# EAGLE design AT4004 (EAGLE 9.2.0)
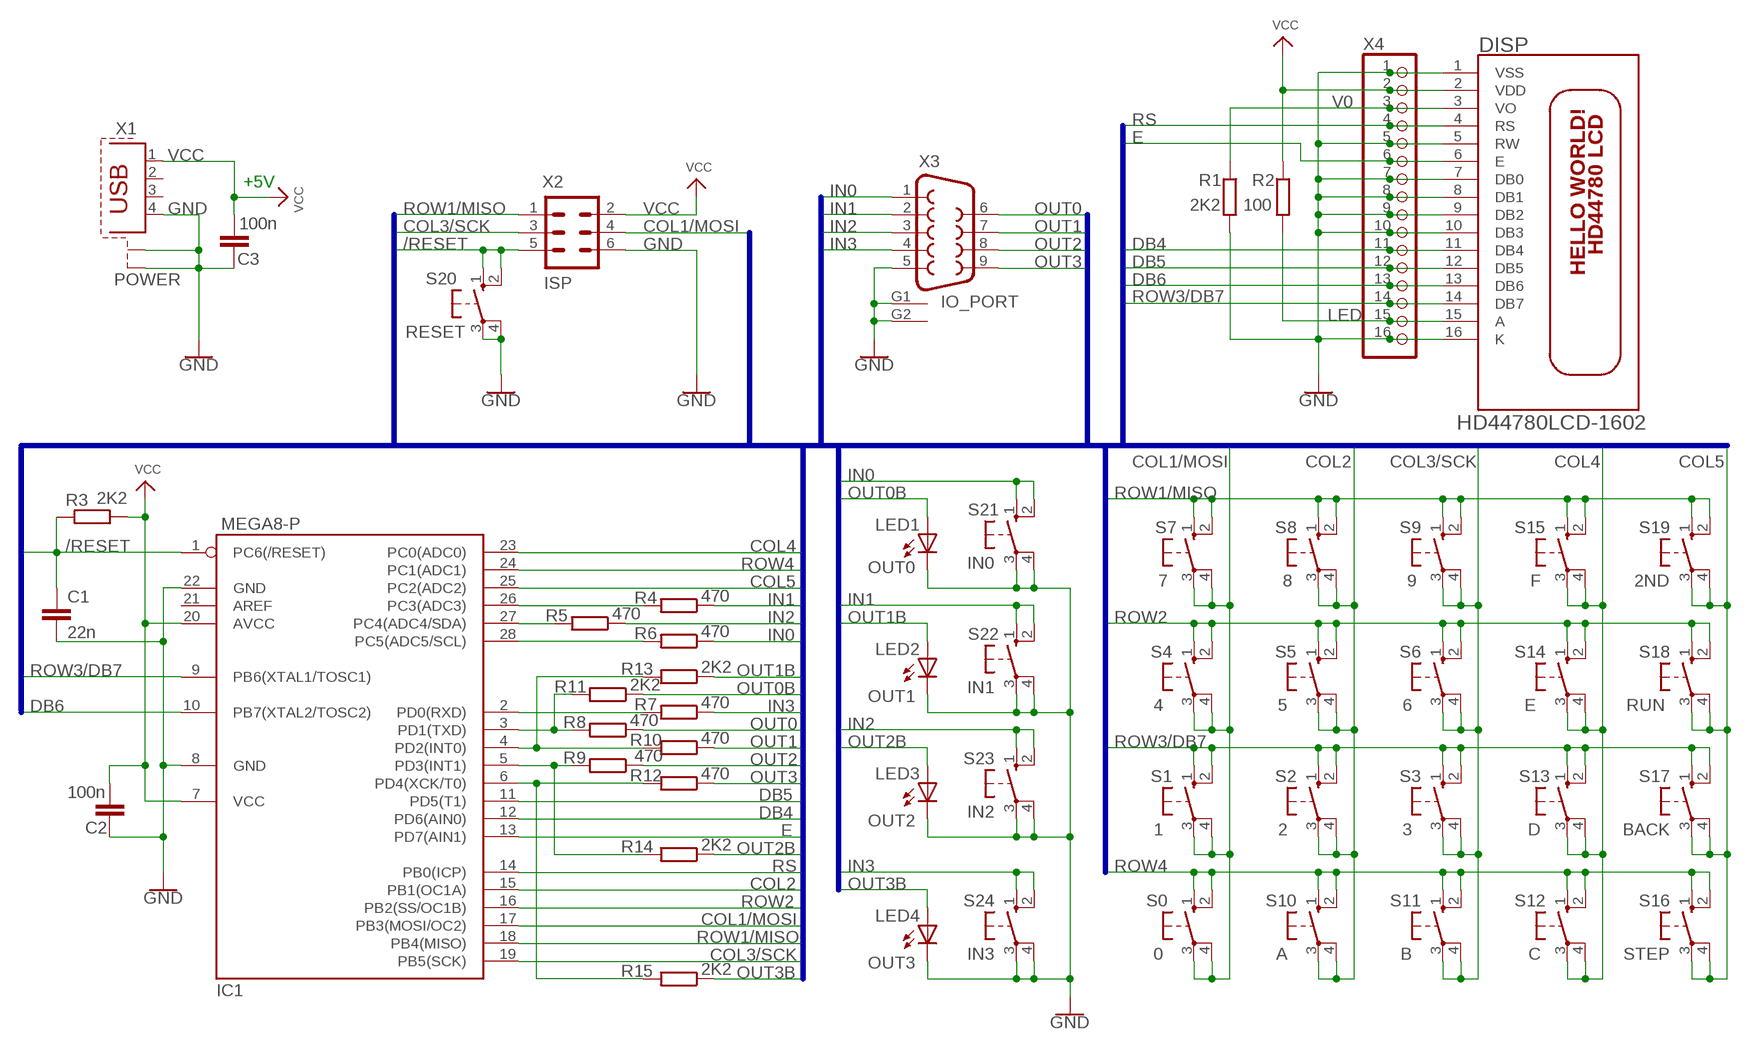
[diagram p0: schematic, sheet 1]

## Parts
C1  22n  C-EU050-024X044  [C050-024X044]
C2  100n  C-EU050-024X044  [C050-024X044]
C3  100n  C-EU050-024X044  [C050-024X044]
DISP  HD44780LCD-1602  [LCD1602]
IC1  MEGA8-P  [DIL28-3]
LED1  OUT0  LED3MM  [LED3MM]
LED2  OUT1  LED3MM  [LED3MM]
LED3  OUT2  LED3MM  [LED3MM]
LED4  OUT3  LED3MM  [LED3MM]
R1  2K2  R-EU_0204/10  [0204/10]
R2  100  R-EU_0204/10  [0204/10]
R3  2K2  R-EU_0204/7  [0204/7]
R4  470  R-EU_0204/10  [0204/10]
R5  470  R-EU_0204/10  [0204/10]
R6  470  R-EU_0204/7  [0204/7]
R7  470  R-EU_0204/10  [0204/10]
R8  470  R-EU_0204/10  [0204/10]
R9  470  R-EU_0204/7  [0204/7]
R10  470  R-EU_0204/10  [0204/10]
R11  2K2  R-EU_0204/10  [0204/10]
R12  470  R-EU_0204/10  [0204/10]
R13  2K2  R-EU_0204/10  [0204/10]
R14  2K2  R-EU_0204/10  [0204/10]
R15  2K2  R-EU_0204/10  [0204/10]
S0  0  10-XX  [B3F-10XX]
S1  1  10-XX  [B3F-10XX]
S2  2  10-XX  [B3F-10XX]
S3  3  10-XX  [B3F-10XX]
S4  4  10-XX  [B3F-10XX]
S5  5  10-XX  [B3F-10XX]
S6  6  10-XX  [B3F-10XX]
S7  7  10-XX  [B3F-10XX]
S8  8  10-XX  [B3F-10XX]
S9  9  10-XX  [B3F-10XX]
S10  A  10-XX  [B3F-10XX]
S11  B  10-XX  [B3F-10XX]
S12  C  10-XX  [B3F-10XX]
S13  D  10-XX  [B3F-10XX]
S14  E  10-XX  [B3F-10XX]
S15  F  10-XX  [B3F-10XX]
S16  STEP  10-XX  [B3F-10XX]
S17  BACK  10-XX  [B3F-10XX]
S18  RUN  10-XX  [B3F-10XX]
S19  2ND  10-XX  [B3F-10XX]
S20  RESET  10-XX  [B3F-10XX]
S21  IN0  10-XX  [B3F-10XX]
S22  IN1  10-XX  [B3F-10XX]
S23  IN2  10-XX  [B3F-10XX]
S24  IN3  10-XX  [B3F-10XX]
X1  POWER  PN61729-S  [PN61729-S]
X2  ISP  ML6  [ML6]
X3  IO_PORT  DB9FEMALE  [DB9]
X4  PINHD-1X16/90  [1X16/90]

## Nets
/RESET: C1.1 IC1.1(PC6(/RESET)) R3.2 S20.1(S) S20.2(S1) X2.5
COL1/MOSI: IC1.17(PB3(MOSI/OC2)) S0.3(P) S0.4(P1) S1.3(P) S1.4(P1) S4.3(P) S4.4(P1) S7.3(P) S7.4(P1) X2.4
COL2: IC1.15(PB1(OC1A)) S2.3(P) S2.4(P1) S5.3(P) S5.4(P1) S8.3(P) S8.4(P1) S10.3(P) S10.4(P1)
COL3/SCK: IC1.19(PB5(SCK)) S3.3(P) S3.4(P1) S6.3(P) S6.4(P1) S9.3(P) S9.4(P1) S11.3(P) S11.4(P1) X2.3
COL4: IC1.23(PC0(ADC0)) S12.3(P) S12.4(P1) S13.3(P) S13.4(P1) S14.3(P) S14.4(P1) S15.3(P) S15.4(P1)
COL5: IC1.25(PC2(ADC2)) S16.3(P) S16.4(P1) S17.3(P) S17.4(P1) S18.3(P) S18.4(P1) S19.3(P) S19.4(P1)
DB4: DISP.11(DB4) IC1.12(PD6(AIN0)) X4.11
DB5: DISP.12(DB5) IC1.11(PD5(T1)) X4.12
DB6: DISP.13(DB6) IC1.10(PB7(XTAL2/TOSC2)) X4.13
E: DISP.6(E) IC1.13(PD7(AIN1)) X4.6
GND: C1.2 C2.2 C3.1 DISP.1(VSS) DISP.5(RW) DISP.7(DB0) DISP.8(DB1) DISP.9(DB2) DISP.10(DB3) DISP.16(K) IC1.8(GND) IC1.22(GND) LED1.K(C) LED2.K(C) LED3.K(C) LED4.K(C) R1.2 S20.3(P) S20.4(P1) S21.3(P) S21.4(P1) S22.3(P) S22.4(P1) S23.3(P) S23.4(P1) S24.3(P) S24.4(P1) X1.4 X1.S1 X1.S2 X2.6 X3.5 X3.G1 X3.G2 X4.1 X4.5 X4.7 X4.8 X4.9 X4.10 X4.16
IN0: R6.1 S21.1(S) S21.2(S1) X3.1
IN1: R4.1 S22.1(S) S22.2(S1) X3.2
IN2: R5.1 S23.1(S) S23.2(S1) X3.3
IN3: R7.1 S24.1(S) S24.2(S1) X3.4
LED: DISP.15(A) R2.2 X4.15
N$1: IC1.26(PC3(ADC3)) R4.2
N$2: IC1.27(PC4(ADC4/SDA)) R5.2
N$3: IC1.28(PC5(ADC5/SCL)) R6.2
N$4: IC1.2(PD0(RXD)) R7.2
N$5: IC1.3(PD1(TXD)) R8.2 R11.2
N$6: IC1.4(PD2(INT0)) R10.2 R13.2
N$7: IC1.5(PD3(INT1)) R9.2 R14.2
N$8: IC1.6(PD4(XCK/T0)) R12.2 R15.2
OUT0: R8.1 X3.6
OUT0B: LED1.A R11.1
OUT1: R10.1 X3.7
OUT1B: LED2.A R13.1
OUT2: R9.1 X3.8
OUT2B: LED3.A R14.1
OUT3: R12.1 X3.9
OUT3B: LED4.A R15.1
ROW1/MISO: IC1.18(PB4(MISO)) S7.1(S) S7.2(S1) S8.1(S) S8.2(S1) S9.1(S) S9.2(S1) S15.1(S) S15.2(S1) S19.1(S) S19.2(S1) X2.1
ROW2: IC1.16(PB2(SS/OC1B)) S4.1(S) S4.2(S1) S5.1(S) S5.2(S1) S6.1(S) S6.2(S1) S14.1(S) S14.2(S1) S18.1(S) S18.2(S1)
ROW3/DB7: DISP.14(DB7) IC1.9(PB6(XTAL1/TOSC1)) S1.1(S) S1.2(S1) S2.1(S) S2.2(S1) S3.1(S) S3.2(S1) S13.1(S) S13.2(S1) S17.1(S) S17.2(S1) X4.14
ROW4: IC1.24(PC1(ADC1)) S0.1(S) S0.2(S1) S10.1(S) S10.2(S1) S11.1(S) S11.2(S1) S12.1(S) S12.2(S1) S16.1(S) S16.2(S1)
RS: DISP.4(RS) IC1.14(PB0(ICP)) X4.4
V0: DISP.3(VO) R1.1 X4.3
VCC: C2.1 C3.2 DISP.2(VDD) IC1.7(VCC) IC1.20(AVCC) R2.1 R3.1 X1.1 X2.2 X4.2
Unconnected: IC1.21(AREF) X1.2 X1.3

## Buses
COL1/MOSI,COL2,COL3/SCK,COL4,COL5,DB4,DB5,DB6,E,IN0,IN1,IN2,IN3,OUT0,OUT0B,OUT1,OUT1B,OUT2,OUT2B,OUT3,OUT3B,/RESET,ROW1/MISO,ROW2,ROW3/DB7,ROW4,RS

## Notes on the sheet
- +5V

## Library data of the parts
C1-C3 = rcl:C-EU: CAPACITOR, European symbol; SPICEPREFIX: C
DISP = adafruit_AT4004:HD44780LCD: HD44780 LCD Standard character type LCDs, available in sizes from 8x1 to 40x4!
IC1 = atmel:MEGA8-P: MICROCONTROLLER 8 Kbytes FLASH, 1 kbytes SRAM, 512 bytes EEPROM, USART, 4-channel 10 bit ADC, 2-channel 8 bit ADC Pin compatible with Atmega48, ATMega88, ATMega168 Source: avr.lbr; OC_FARNELL: unknown; OC_NEWARK: unknown
LED1-LED4 = adafruit:LED: LED OSRAM: - CHIPLED LG R971, LG N971, LY N971, LG Q971, LY Q971, LO R971, LY R971 LH N974, LH R974 LS Q976, LO Q976, LY Q976 LO Q996 - Hyper CHIPLED LW Q18S LB Q993, LB Q99A, LB R99A - SideLED LS A670, LO A670, LY A670, LG A670, LP A670 LB A673, LV A673, LT A673, LW A673 LH A674 LY A675 LS A676, LA A676, LO A676, LY A676, LW A676 LS A679, LY A679, LG A679 - Hyper Micro SIDELED® LS Y876, LA Y876, LO Y876, LY Y876 LT Y87S - SmartLED LW L88C, LW L88S LB L89C, LB L89S, LG L890 LS L89K, LO L89K, LY L89K LS L896, LA L896, LO L896, LY L896 - TOPLED LS T670, LO T670, LY T670, LG T670, LP T670 LSG T670, LSP T670, LSY T670, LOP T670, LYG T670 LG T671, LOG T671, LSG T671 LB T673, LV T673, LT T673, LW T673 LH T674 LS T676, LA T676, LO T676, LY T676, LB T676, LH T676, LSB T676, LW T676 LB T67C, LV T67C, LT T67C, LS T67K, LO T67K, LY T67K, LW E67C LS E67B, LA E67B, LO E67B, LY E67B, LB E67C, LV E67C, LT E67C LW T67C LS T679, LY T679, LG T679 LS T770, LO T770, LY T770, LG T770, LP T770 LB T773, LV T773, LT T773, LW T773 LH T774 LS E675, LA E675, LY E675, LS T675 LS T776, LA T776, LO T776, LY T776, LB T776 LHGB T686 LT T68C, LB T68C - Hyper Mini TOPLED® LB M676 - Mini TOPLED Santana® LG M470 LS M47K, LO M47K, LY M47K Source: http://www.osram.convergy.de/
R1 R2 R4 R5 R7 R8 R10-R15 = rcl:R-EU_: RESISTOR, European symbol
R3 R6 R9 = rcl:R-EU_: RESISTOR, European symbol; SPICEPREFIX: R
S0 S1-S24 = switch-omron2:10-XX: OMRON SWITCH; MPN: B3F-1000; OC_FARNELL: 176432; OC_NEWARK: 36M3542
X1 = con-berg:PN61729-S: BERG USB connector; OC_FARNELL: unknown; OC_NEWARK: unknown
X2 = con-ml:ML6: HARTING; OC_FARNELL: unknown; OC_NEWARK: unknown
X3 = SparkFun-Connectors:DB9: DB9 Connector Standard DB9 (D-Sub 9) serial connector. Can be used for CAN bus as well as RS485 and RS232. Footprint production proven. Here is the female version connector we sell at SparkFun: 9 Pin Female Serial Connector - PCB Mount <https://www.sparkfun.com/products/429> (PRT-00429) This connector has been used on the following SparkFun products: SparkFun RS232 Shifter - SMD <https://www.sparkfun.com/products/449> (PRT-00449) SparkFun RS232 Shifter SMD (No DB9) <https://www.sparkfun.com/products/8780> (PRT-08780); PROD_ID: CONN-08194
X4 = pinhead:PINHD-1X16: PIN HEADER

## Board
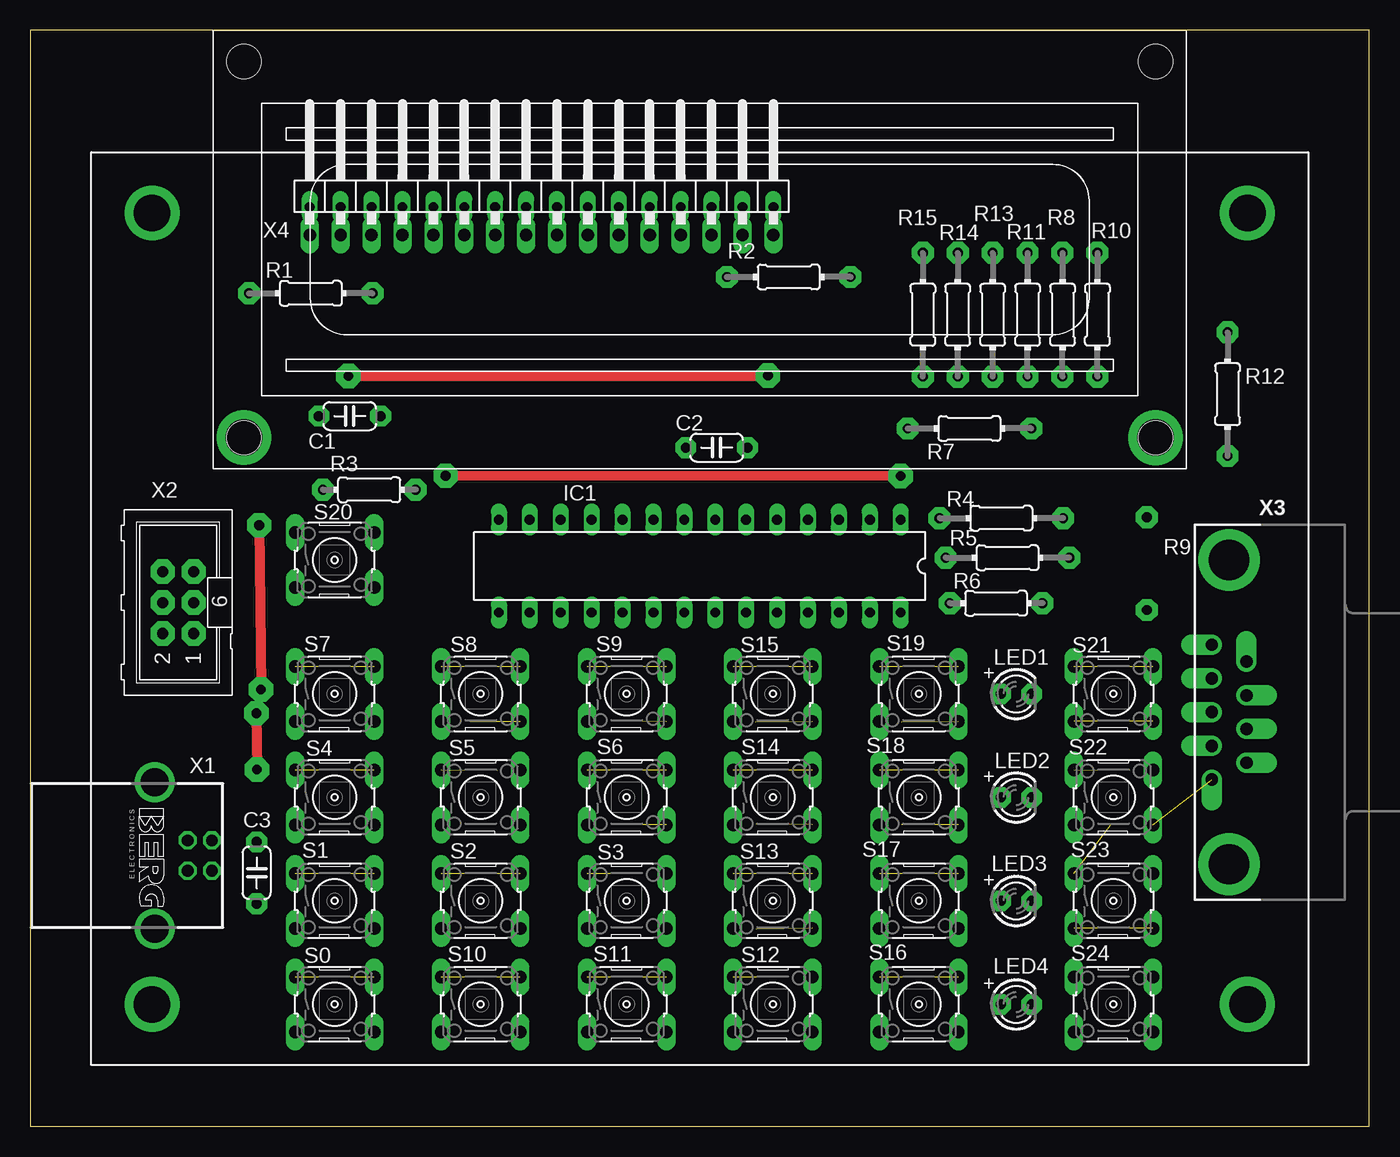
[diagram p1: board, top side]
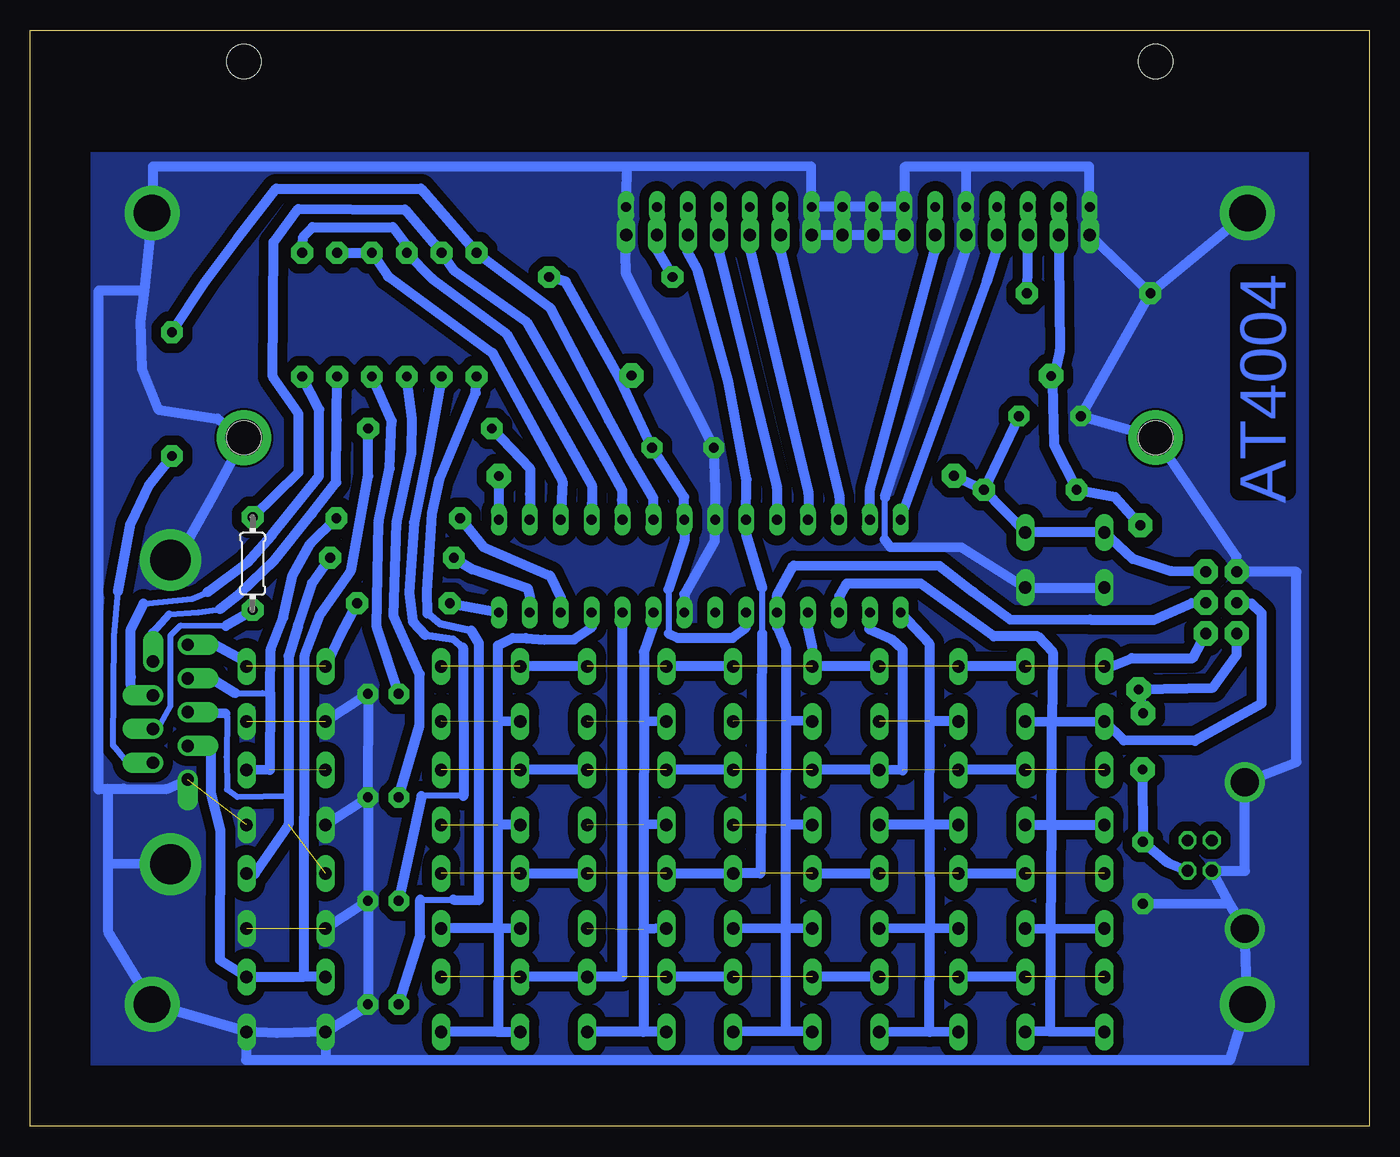
[diagram p2: board, bottom side, seen from below]

Size 110 x 90 mm. Coordinates in mm from the lower left corner, seen from the top.
Outline: 0,0 110,0 110,90 0,90 0,0
Copper layers (1*16): Top 0.035mm / dielectric 1.5mm / Bottom 0.035mm
Design rules "default": minimum track width 6mil, minimum drill 0.35mm, track to track 6mil, track to pad 6mil, pad to pad 6mil, via to via 6mil, smd to smd 6mil, copper to edge 40mil, drill to drill 6mil, minimum pad ring 10mil, minimum via ring 8mil, stop-mask expansion 4mil, vias tented up to drill 0mil, thermal gap 10mil

### Footprints (pad centres in the part's own frame; a part is rotated, then mirrored left to right if it is on the bottom)
C050-024X044 = drill 0.813 pad 1.7 octagon: 1 -2.54,0; 2 2.54,0
LCD1602 = drill 0.8 long: 1 7.949,21.5; 2 10.489,21.5; 3 13.029,21.5; 4 15.569,21.5; 5 18.109,21.5; 6 20.649,21.5; 7 23.189,21.5; 8 25.729,21.5; 9 28.269,21.5; 10 30.809,21.5; 11 33.349,21.5; 12 35.889,21.5; 13 38.429,21.5; 14 40.969,21.5; 15 43.509,21.5; 16 46.049,21.5 | hole 2.8: 2.54,2.54; 2.54,33.46; 77.46,33.46; 77.46,2.54
DIL28-3 = drill 0.813 long: 1 -16.51,-3.81; 2 -13.97,-3.81; 3 -11.43,-3.81; 4 -8.89,-3.81; 5 -6.35,-3.81; 6 -3.81,-3.81; 7 -1.27,-3.81; 8 1.27,-3.81; 9 3.81,-3.81; 10 6.35,-3.81; 11 8.89,-3.81; 12 11.43,-3.81; 13 13.97,-3.81; 14 16.51,-3.81; 15 16.51,3.81; 16 13.97,3.81; 17 11.43,3.81; 18 8.89,3.81; 19 6.35,3.81; 20 3.81,3.81; 21 1.27,3.81; 22 -1.27,3.81; 23 -3.81,3.81; 24 -6.35,3.81; 25 -8.89,3.81; 26 -11.43,3.81; 27 -13.97,3.81; 28 -16.51,3.81
LED3MM = drill 0.813 pad 1.676 octagon: A -1.27,0; K 1.27,0
0204/10 = drill 0.813 pad 1.8 octagon: 1 -5.08,0; 2 5.08,0
0204/7 = drill 0.813 pad 1.8 octagon: 1 -3.81,0; 2 3.81,0
B3F-10XX = drill 1.016 long: 1 -3.251,2.261; 2 3.251,2.261; 3 -3.251,-2.261; 4 3.251,-2.261
PN61729-S = drill 0.95 octagon: 1 1.25,4.71; 2 -1.25,4.71; 3 -1.25,2.71; 4 1.25,2.71 | drill 2.3 pad 2.9: S1 -6.02,0; S2 6.02,0
ML6 = drill 0.914 pad 2 octagon: 1 -2.54,-1.27; 2 -2.54,1.27; 3 0,-1.27; 4 0,1.27; 5 2.54,-1.27; 6 2.54,1.27
DB9 = drill 1.016 pad 1.676 offset: 1 -5.54,-1.42; 2 -2.77,-1.42; 3 0,-1.42; 4 2.77,-1.42; 5 5.54,-1.42; 6 -4.15,1.42; 7 -1.38,1.42; 8 1.38,1.42; 9 4.15,1.42 | drill 3.302 pad 5.08: G1 -12.5,0; G2 12.5,0
1X16/90 = drill 1.016 long: 1 -19.05,-3.81; 2 -16.51,-3.81; 3 -13.97,-3.81; 4 -11.43,-3.81; 5 -8.89,-3.81; 6 -6.35,-3.81; 7 -3.81,-3.81; 8 -1.27,-3.81; 9 1.27,-3.81; 10 3.81,-3.81; 11 6.35,-3.81; 12 8.89,-3.81; 13 11.43,-3.81; 14 13.97,-3.81; 15 16.51,-3.81; 16 19.05,-3.81

### Placement (x,y rotation side)
C1  26.24,58.32 180 top
C2  56.39,55.73 180 top
C3  18.59,20.8 90 top
DISP  15,54 0 top
IC1  55,46 180 top
LED1  81,35.5 0 top
LED2  81,27 0 top
LED3  81,18.5 0 top
LED4  81,10 0 top
R1  23.04,68.4 180 top
R2  62.31,69.75 180 top
R3  27.84,52.27 0 top
R4  79.78,49.94 180 top
R5  80.29,46.69 180 top
R6  79.35,42.95 180 top
R7  77.17,57.3 180 top
R8  84.81,66.65 90 top
R9  91.74,46.2 90 bottom
R10  87.68,66.65 90 top
R11  81.94,66.65 90 top
R12  98.37,60.12 90 top
R13  79.07,66.65 90 top
R14  76.2,66.65 90 top
R15  73.33,66.65 90 top
S0  25,10 0 top
S1  25,18.5 0 top
S2  37,18.5 0 top
S3  49,18.5 0 top
S4  25,27 0 top
S5  37,27 0 top
S6  49,27 0 top
S7  25,35.5 0 top
S8  37,35.5 0 top
S9  49,35.5 0 top
S10  37,10 0 top
S11  49,10 0 top
S12  61,10 0 top
S13  61,18.5 0 top
S14  61,27 0 top
S15  61,35.5 0 top
S16  73,10 0 top
S17  73,18.5 0 top
S18  73,27 0 top
S19  73,35.5 0 top
S20  25,46.5 0 top
S21  89,35.5 0 top
S22  89,27 0 top
S23  89,18.5 0 top
S24  89,10 0 top
X1  10.21,22.23 270 top
X2  12.14,43 90 top
X3  98.5,34 270 top
X4  42,77 0 top

### Tracks (layer width: path | path; a pad name or v marks a point on that pad's centre or on a via)
/RESET  (via drill 0.8 pad 2)
  Top 0.813: v71.5,53.39 v34.11,53.42
  Bottom 0.813: C1.1 R3.2 | IC1.1 v71.5,53.39 | v34.11,53.42 R3.2 | X2.5 16.28,45.59 19.43,46.58 S20.1 S20.2 R3.2
COL1/MOSI
  Bottom 0.508: 26.21,7.78 26.24,7.77
  Bottom 0.813: 26.07,33.22 25.98,38.94 27.23,40.23 30.84,40.23 36.83,44.55 42.93,44.55 43.54,43.54 IC1.17 | 26.13,24.74 26.07,33.22 | 26.13,24.74 26.18,16.23 | 26.18,16.23 26.21,7.78 S0.3 | 26.24,7.77 S0.4 | S1.4 26.18,16.23 | S4.4 26.13,24.74 | S7.4 26.07,33.22 | X2.4 9.65,42.93 8.84,42.16 8.84,34.7 14.3,31.65 20.17,31.67 S7.3 26.07,33.22 | 26.18,16.23 S1.3 | 26.13,24.74 S4.3
COL2  (1 unrouted)
  Bottom 0.508: 36.17,24.74 36.12,24.74
  Bottom 0.813: IC1.15 36.14,39.65 36.14,33.25 | 36.14,33.25 36.17,24.74 S5.3 | 36.08,16.23 36.12,24.74 S5.4 | 36.12,7.72 36.08,16.23 | S10.3 36.12,7.72 | S2.3 36.08,16.23 | S8.3 36.14,33.25 | 36.12,7.72 S10.4 | 36.08,16.23 S2.4
COL3/SCK  (2 unrouted)
  Bottom 0.813: 47.9,33.3 47.9,39.24 48.62,40.97 IC1.19 48.64,43.61 47.3,46.05 35.31,46.02 32.51,43.87 29.52,41.63 22.91,41.6 17.7,41.58 14.61,42.95 X2.3 | 47.9,33.3 47.94,24.74 | 47.94,24.74 47.95,16.2 | 47.95,16.2 47.95,7.8 | S11.3 47.95,7.8 | S3.3 47.95,16.2 | S6.3 47.94,24.74 | S9.3 47.9,33.3 | 47.95,7.8 S11.4 | 47.95,16.2 S3.4
COL4  (3 unrouted)
  Bottom 0.813: IC1.23 58.85,41.07 59.59,38.94 59.6,33.19 | 59.6,33.19 59.6,24.79 | 59.6,24.79 59.63,16.18 | 59.63,16.18 59.64,7.75 | S12.3 59.64,7.75 | S13.3 59.63,16.18 | S14.3 59.6,24.79 | S15.3 59.6,33.19 | 59.64,7.75 S12.4
COL5  (2 unrouted)
  Bottom 0.508: 71.56,16.21 71.53,16.23
  Bottom 0.813: 71.56,33.2 71.58,39.5 70.36,40.11 69.29,40.08 67.74,39.95 65.33,39.98 63.86,41 IC1.25 | 71.56,24.74 71.56,33.2 | 71.56,24.74 71.56,16.21 S17.3 | 71.58,7.75 71.53,16.23 S17.4 | 71.58,7.75 S16.3 | S18.3 71.56,24.74 | S19.3 71.56,33.2 | 71.58,7.75 S16.4
DB4
  Bottom 0.813: IC1.12 43.54,51.71 48.39,71.86 X4.11 DISP.11
DB5
  Bottom 0.813: IC1.11 46.08,51.99 50.88,71.98 X4.12 DISP.12
DB6
  Bottom 0.813: IC1.10 48.67,52.45 53.39,71.6 X4.13 DISP.13
E
  Bottom 0.813: IC1.13 41,52.32 35.7,71.77 | 35.7,71.77 35.66,73 X4.6 | DISP.6 35.7,71.77
GND  (via drill 3 pad 4.5)  (3 unrouted)
  Bottom 0.508: 61.05,76.29 X4.16 | 39.8,48.18 39.78,51.64 | LED2.K 82.29,26.95 | LED4.K 82.25,9.85
  Bottom 0.813: S20.3 S20.4 33.48,47.52 39.34,47.55 39.8,48.18 | 11.49,18.29 X1.S2 v10,10 11.4,5.44 85.72,5.45 | 11.49,18.29 X1.4 10.21,20.95 X1.S1 5.97,29.9 5.97,45.52 X2.6 10.9,46.79 v17.54,56.56 C1.2 R1.2 | C3.1 11.49,18.29 | v10,75 R1.2 | R1.2 X4.1 22.99,78.82 33.12,78.82 | 33.12,78.82 X4.5 | 33.12,78.82 38.18,78.79 X4.7 | X4.7 X4.8 | X4.8 X4.9 | X4.9 X4.10 | X4.10 45.81,75.52 | 45.81,75.52 45.82,78.84 61.04,78.82 | 61.04,78.82 61.05,76.29 61.06,73.43 61.08,71.71 | 39.78,51.64 33.12,71.93 X4.5 | IC1.22 56.26,43.69 53.77,48.06 IC1.8 53.72,52.27 C2.2 61.06,70.03 61.08,71.71 | 61.04,78.82 99.95,78.82 v100,75 100.65,68.67 | 100.65,68.67 100.97,66.12 100.84,62.2 99.49,58.85 94.64,58.12 v92.45,56.55 95.05,51.66 97.81,46.79 X3.G1 | S24.4 v100,10 103.61,15.95 103.61,21.56 | 103.61,21.56 103.62,27.7 | 103.62,27.7 102.36,27.71 98.86,27.69 X3.5 | X3.G2 103.61,21.56 | S24.4 92.28,5.44 85.72,5.45 | S21.3 LED1.K 82.29,26.95 S22.3 | LED3.K S23.3 | 85.72,5.45 85.75,7.59 85.19,8.05 82.25,9.85 LED3.K | S24.3 89.74,7.64 S24.4 | LED2.K LED3.K | 103.62,27.7 104.39,27.64 104.37,68.66 100.65,68.67 | DISP.5 X4.5 | X4.7 DISP.7 DISP.8 | DISP.8 X4.8 | DISP.9 X4.9 | DISP.10 X4.10 | DISP.16 61.08,71.71 | DISP.8 DISP.9 | DISP.9 45.81,75.52
  pour Bottom (isolate 0.8, no thermals): 5,5 105,5 105,80 5,80
IN0  (1 unrouted)
  Bottom 0.813: S21.2 92.53,38.28 94.87,39.55 X3.1 | R6.1 84.53,40.34 S21.1
IN1  (1 unrouted)
  Bottom 0.508: 93.14,35.56 90.93,35.56 90.29,35.53
  Bottom 0.813: X3.2 94.94,36.68 93.14,35.56 | S22.2 90.32,29.23 90.29,35.53 90.25,39.17 89.23,41.76 88.44,45.26 87,47.83 R4.1
IN2  (1 unrouted)
  Bottom 0.508: 93.98,33.91 93.85,33.68 93.88,30.3 93.85,27.66 92.99,27.05 88.79,27.12
  Bottom 0.813: X3.3 93.98,33.91 | R5.1 86.87,44.6 88.01,41.15 88.8,38.61 88.79,27.12 88.8,24.77 91.57,20.73 S23.2
IN3
  Bottom 0.813: X3.4 95.15,31.11 95.15,27.33 94.39,24.31 94.41,13.64 S24.2 87.5,12.27 | 87.5,12.27 87.45,38.68 86.21,41.99 83.67,45.62 82.25,53.42 R7.1 | S24.1 87.5,12.27
LED
  Bottom 0.813: R2.2 58.5,71.96 X4.15 DISP.15
N$1
  Bottom 0.813: R4.2 72.8,47.57 67.31,45.21 66.42,43.41 IC1.26
N$2
  Bottom 0.813: R5.2 73.69,45.72 69.14,44.17 68.96,43.36 IC1.27
N$3
  Bottom 0.813: R6.2 IC1.28
N$4
  Bottom 0.813: R7.2 68.96,54.03 68.96,51.92 IC1.2
N$5
  Bottom 0.813: R8.2 84.64,71.75 R11.2 80.62,69.8 72.02,63.49 69.67,59.21 66.29,52.96 66.34,51.41 IC1.3
N$6
  Bottom 0.813: R10.2 87.58,73.05 86.82,73.84 80.21,73.84 79.15,72.42 R13.2 76.98,69.61 70.89,65.08 63.86,52.6 63.86,51.13 IC1.4
N$7
  Bottom 0.813: R9.2 87.96,53.7 87.96,58.5 90.09,61.57 90.02,72.62 87.99,75.34 79.22,75.29 R14.2 75.21,70.31 69.24,66.06 62.84,54.84 61.37,52.22 61.39,51.41 IC1.5
N$8
  Bottom 0.813: R12.2 95.63,69.37 92.94,72.97 89.79,77.01 77.91,77.01 R15.2 67.31,67.24 62.46,57.96 60.63,54.63 58.83,51.59 IC1.6
OUT0
  Bottom 0.508: 98.6,42.04 96.19,42.19 94.44,42.47
  Bottom 0.61: 99.95,40.51 98.6,42.04
  Bottom 0.813: X3.6 99.95,40.51 | 94.44,42.47 92.71,43.81 89.96,46.46 86.88,50.28 84.86,52.88 84.84,57.99 R8.1
OUT0B
  Bottom 0.813: LED1.A 81.54,40.96 81.38,49.63 80.47,54.03 80.31,57.94 R11.1
OUT1
  Bottom 0.508: 100.71,42.93 96.72,43.31 95.45,43.87
  Bottom 0.813: X3.7 101.73,35.46 101.75,36.91 101.78,40.72 100.71,42.93 | 95.45,43.87 92.18,46.28 90.17,48.51 86.28,53.39 86.26,58.85 R10.1
OUT1B
  Bottom 0.813: LED2.A 78.03,32.87 78,37.13 80.16,41.94 79.89,49.56 78.69,55.3 78.64,58.12 R13.1
OUT2
  Bottom 0.508: 99.49,32.66 98.48,34.52 98.48,40.31 97.64,41.12 93.95,41.1
  Bottom 0.813: X3.8 99.49,32.66 | 93.95,41.1 R9.1
OUT2B
  Bottom 0.508: 74.42,27.13 77.88,27.13
  Bottom 0.61: 77.55,40.34 75.29,39.98 74.45,39.29
  Bottom 0.813: R14.1 77.27,55.58 78.48,49.6 78.87,43.79 78.59,41.45 77.55,40.34 | 74.45,39.29 74.42,27.13 | 77.88,27.13 LED3.A
OUT3
  Bottom 0.508: 102.03,29.9 103.2,31.27 103.12,40.28 102.79,43.92
  Bottom 0.813: X3.9 102.03,29.9 | 102.79,43.92 101.75,49.53 100.28,52.65 R12.1
OUT3B
  Bottom 0.508: 77.98,18.59 75.23,18.59
  Bottom 0.61: 73.76,40.69 76.33,41.27 77.37,42.11
  Bottom 0.813: LED4.A 77.98,15.57 77.98,18.59 | 75.23,18.59 73.15,18.57 73.15,39.67 73.76,40.69 | 77.37,42.11 77.42,43.92 77.01,50.32 76.38,53.14 73.41,60.22 R15.1
ROW1/MISO  (5 unrouted)
  Bottom 0.508: S9.1 45.74,39.32
  Bottom 0.813: S7.2 S8.1 | S8.2 S9.1 | 45.74,39.32 46.1,41.02 IC1.18 | S7.1 21.23,37.74 19.51,38.43 14.5,38.43 X2.1 | S9.2 S15.1 | S15.2 S19.1
ROW2  (5 unrouted)
  Bottom 0.813: IC1.16 41.07,40.82 39.29,40.03 38.33,39.17 38.33,29.21 S5.2 S6.1 | S4.2 S5.1 | S6.2 S14.1 | S14.2 S18.1
ROW3/DB7  (5 unrouted)
  Bottom 0.508: IC1.9 51.18,48.56 | 49.89,44.2 49.89,40.46
  Bottom 0.813: S17.1 S13.2 | S13.1 S3.2 50.01,20.75 49.89,40.46 | S3.1 S2.2 | S2.1 S1.2 | 51.18,48.56 49.89,44.2 | IC1.9 51.16,53.11 52.65,61.11 55.19,70.36 56.01,71.83 X4.14 DISP.14
ROW4  (5 unrouted)
  Bottom 0.813: S0.2 S10.1 | S10.2 S11.1 | S11.2 S12.1 | S16.1 S12.2 61.37,12.27 61.37,40.64 IC1.24
RS
  Bottom 0.813: IC1.14 31.42,69.34 30.58,71.98 X4.4 DISP.4
V0
  Bottom 0.813: R1.1 28.07,70.84 X4.3 DISP.3
VCC  (via drill 0.8 pad 2)
  Top 0.813: v18.8,49.35 v18.95,35.87 | v18.57,33.91 v18.62,29.29 | v26.14,61.62 v60.6,61.65
  Bottom 0.508: X4.2 25.53,73.05 | 57.58,44.07 57.56,40.46
  Bottom 0.813: X1.1 16.54,21.64 C3.2 v18.62,29.29 | 25.53,73.05 25.49,71.38 | 25.49,71.38 25.43,63.73 26.04,61.04 | 26.04,61.04 25.88,55.96 R3.1 20.88,51.69 v18.8,49.35 | 61.55,61.33 C2.1 56.29,51.66 IC1.7 56.26,48.06 57.58,44.07 | 61.55,61.33 66.02,69.37 R2.1 | 57.56,40.46 56.79,40.11 52.3,40.11 51.21,40.95 IC1.20 | v18.57,33.91 v18.95,35.87 12.83,36.02 10.87,38.71 X2.2 | v60.6,61.65 61.55,61.33 | v26.14,61.62 26.04,61.04 | DISP.2 25.49,71.38

### Text on the board
Bottom: AT4004